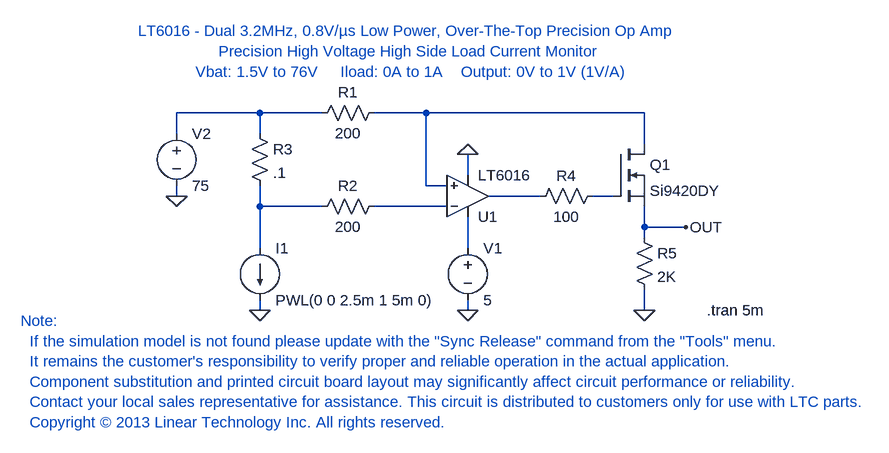
[diagram p0: schematic LT6016_TA01A.asc]
LT6016_TA01A.asc, the LTspice schematic file:
Version 4
SHEET 1 1408 800
WIRE 112 64 -16 64
WIRE 208 64 112 64
WIRE 368 64 288 64
WIRE 704 64 368 64
WIRE -16 96 -16 64
WIRE 112 96 112 64
WIRE 704 112 704 64
WIRE 432 160 432 128
WIRE 368 176 368 64
WIRE 400 176 368 176
WIRE -16 192 -16 176
WIRE 544 192 464 192
WIRE 656 192 624 192
WIRE 112 208 112 176
WIRE 208 208 112 208
WIRE 400 208 288 208
WIRE 704 240 704 208
WIRE 768 240 704 240
WIRE 704 256 704 240
WIRE 112 272 112 208
WIRE 432 272 432 224
WIRE 112 368 112 352
WIRE 432 368 432 352
WIRE 704 368 704 336
FLAG 432 368 0
FLAG -16 192 0
FLAG 768 240 OUT
FLAG 112 368 0
FLAG 432 128 0
FLAG 704 368 0
SYMBOL LT6016 432 192 M180
SYMATTR InstName U1
SYMBOL voltage 432 256 R0
WINDOW 123 0 0 Left 2
WINDOW 39 0 0 Left 2
SYMATTR InstName V1
SYMATTR Value 5
SYMBOL voltage -16 80 R0
WINDOW 123 0 0 Left 2
WINDOW 39 0 0 Left 2
SYMATTR InstName V2
SYMATTR Value 75
SYMBOL res 304 48 R90
WINDOW 0 0 56 VBottom 2
WINDOW 3 32 56 VTop 2
SYMATTR InstName R1
SYMATTR Value 200
SYMBOL res 304 192 R90
WINDOW 0 0 56 VBottom 2
WINDOW 3 32 56 VTop 2
SYMATTR InstName R2
SYMATTR Value 200
SYMBOL res 96 80 R0
SYMATTR InstName R3
SYMATTR Value .1
SYMBOL load2 112 272 R0
WINDOW 123 0 0 Left 2
WINDOW 39 0 0 Left 2
SYMATTR InstName I1
SYMATTR Value PWL(0 0 2.5m 1 5m 0)
SYMBOL res 640 176 R90
WINDOW 0 0 56 VBottom 2
WINDOW 3 32 56 VTop 2
SYMATTR InstName R4
SYMATTR Value 100
SYMBOL nmos 656 112 R0
SYMATTR InstName Q1
SYMATTR Value Si9420DY
SYMBOL res 688 240 R0
SYMATTR InstName R5
SYMATTR Value 2K
TEXT 800 368 Left 2 !.tran 5m
TEXT 344 16 Bottom 2 ;LT6016 - Dual 3.2MHz, 0.8V/µs Low Power, Over-The-Top Precision Op Amp \nPrecision High Voltage High Side Load Current Monitor\nVbat: 1.5V to 76V     Iload: 0A to 1A    Output: 0V to 1V (1V/A)
TEXT -256 384 Left 2 ;Note:\n  If the simulation model is not found please update with the "Sync Release" command from the "Tools" menu.\n  It remains the customer's responsibility to verify proper and reliable operation in the actual application.\n  Component substitution and printed circuit board layout may significantly affect circuit performance or reliability.\n  Contact your local sales representative for assistance. This circuit is distributed to customers only for use with LTC parts.\n  Copyright © 2013 Linear Technology Inc. All rights reserved.

The netlist it stands for:
* LT6016_TA01A.asc
* U1: LT6016 (symbol LT6016 not available, pins judged from their places): In+=N002 In-=N006 V+=N007 V-=0 OUT=N003
V1 N007 0 5
V2 N001 0 75
R1 N002 N001 200
R2 N006 N005 200
R3 N001 N005 .1
I1 N005 0 PWL(0 0 2.5m 1 5m 0)
R4 N004 N003 100
M§Q1 N002 N004 OUT OUT Si9420DY
R5 OUT 0 2K
.model NMOS NMOS
.model PMOS PMOS
.lib standard.mos
.tran 5m
* LT6016 - Dual 3.2MHz, 0.8V/µs Low Power, Over-The-Top Precision Op Amp
* Precision High Voltage High Side Load Current Monitor
* Vbat: 1.5V to 76V     Iload: 0A to 1A    Output: 0V to 1V (1V/A)
* Note:
*   If the simulation model is not found please update with the "Sync Release" command from the "Tools" menu.
*   It remains the customer's responsibility to verify proper and reliable operation in the actual application.
*   Component substitution and printed circuit board layout may significantly affect circuit performance or reliability.
*   Contact your local sales representative for assistance. This circuit is distributed to customers only for use with LTC parts.
*   Copyright © 2013 Linear Technology Inc. All rights reserved.
.backanno
.end